# Altium schematic sheet CapModule.SchDoc
size A4
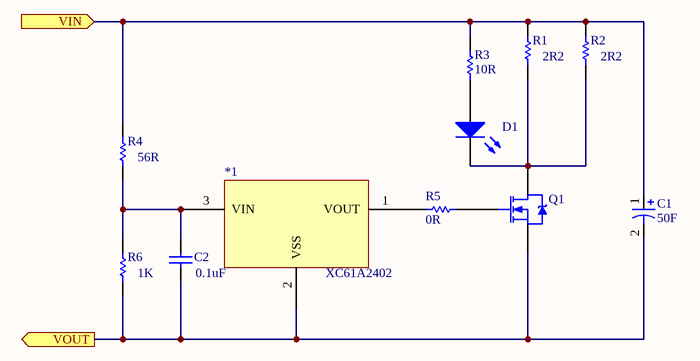
[diagram p0: CapModule.SchDoc]

## Parts
*1  XC61A2402  [SOT23-3N]
C1  value 50F  [CAP 7.5*18*35.5 - GD]  (hidden comment: Cap Pol1)
C2  value 0.1uF  [0603C]  (hidden comment: Cap)
D1  LED0  [LED 0603B]  (value not drawn)
Q1  NMOS-2  [sot23]  (value not drawn)
R1  value 2R2  [2512R]  (hidden comment: Res1)
R2  value 2R2  [2512R]  (hidden comment: Res1)
R3  value 10R  [0603R]  (hidden comment: Res1)
R4  value 56R  [0603R]  (hidden comment: Res1)
R5  value 0R  [0603R]  (hidden comment: Res1)
R6  value 1K  [0603R]  (hidden comment: Res1)

## Ports
VIN (in), VOUT (out)

## Nets
VIN: C1.1 R1.2 R2.2 R3.1 R4.2 ; port VIN
VOUT: *1.2(VSS) C1.2 C2.1 Q1.3(S) R6.1 ; port VOUT
Net*1_1: *1.1(VOUT) R5.2
Net*1_3: *1.3(VIN) C2.2 R4.1 R6.2
NetD1_1: D1.1(A) R3.2
NetD1_2: D1.2(K) Q1.2(D) R1.1 R2.1
NetQ1_1: Q1.1(G) R5.1

## Library data of the parts
*1 = XC61A
C1 = Cap Pol1: Polarized Capacitor (Radial) 2.7v; Published: 8-Jun-2000; LatestRevisionDate: 17-Jul-2002; LatestRevisionNote: Re-released for DXP Platform.; PackageReference: RB7.6-15; Publisher: Altium Limited; PackageDescription: Polarized Capacitor (Radial); 2 Leads
C2 = Cap: Capacitor; Published: 8-Jun-2000; LatestRevisionDate: 17-Jul-2002; LatestRevisionNote: Re-released for DXP Platform.; PackageReference: RAD-0.3; Publisher: Altium Limited; PackageDescription: Radial Cap, Thru-Hole; 2 Leads; 0.3 in Pin Spacing
D1 = LED0: Typical INFRARED GaAs LED; Published: 8-Jun-2000; LatestRevisionDate: 08-Jul-2005; LatestRevisionNote: Mech Layer 1 removed.; PackageReference: LED-0; Publisher: Altium Limited; PackageDescription: LED; 2 Leads
Q1 = NMOS-2: IRLML2502PbF; Note: Pin 2 is electrically connected to pin 4.; Published: 8-Jun-2000; LatestRevisionDate: 17-Jul-2002; LatestRevisionNote: Re-released for DXP Platform.; DatasheetVersion: PD-9.814; PackageVersion: Feb-1997; PackageReference: TO-220AB; Publisher: Altium Limited; PackageDescription: TO, Thru-Hole, Vertical, Heatsink Mounted; 3 In-Line Leads; Pitch 2.54 mm; ComponentLink1Description: Manufacturer Link; ComponentLink1URL: http://www.irf.com/
R1-R6 = Res1: Resistor; Published: 8-Jun-2000; LatestRevisionDate: 17-Jul-2002; LatestRevisionNote: Re-released for DXP Platform.; PackageReference: AXIAL-0.3; Publisher: Altium Limited; PackageDescription: Axial Device, Thru-Hole; 2 Leads; 0.3 in Pin Spacing